# Altium schematic sheet CW308T-FE310-G002.SchDoc: FE310-G002 MCU and SPI
size Letter; SheetNumber: 1; SheetTotal: 2; SheetApproved: Yes
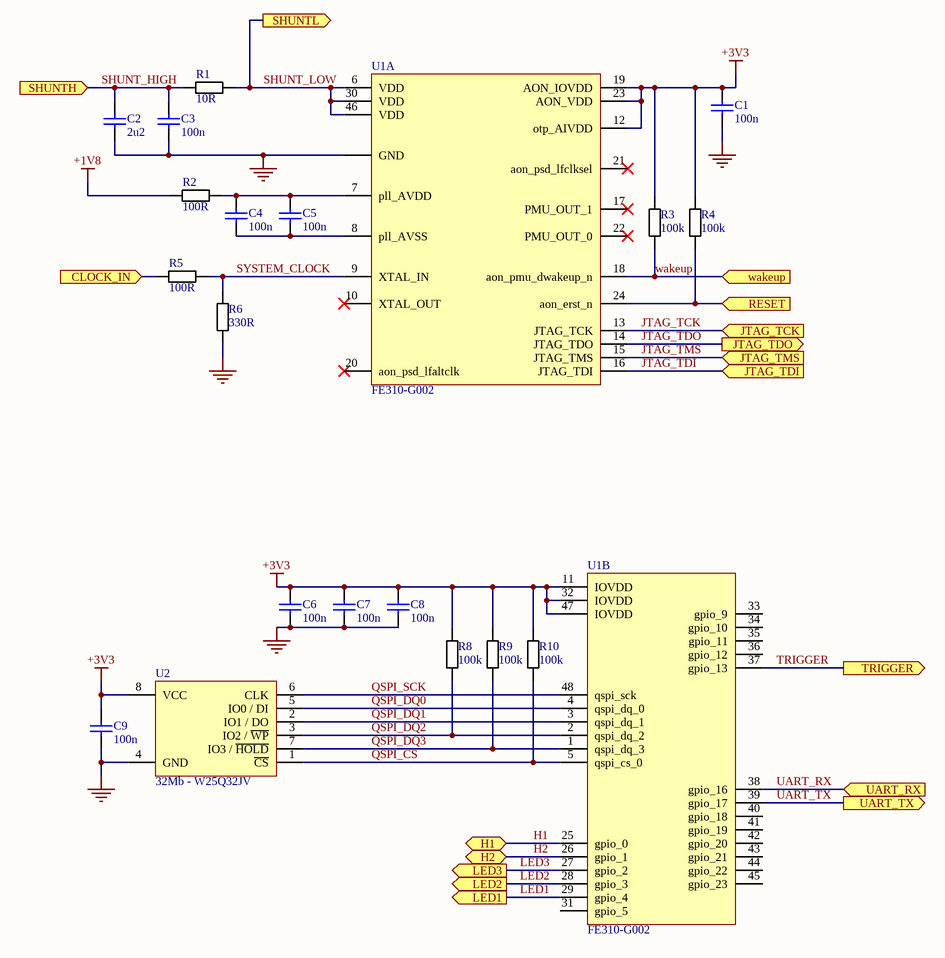
[diagram p0: CW308T-FE310-G002.SchDoc]

## Parts
C1  100n  [CAPC0603_M]
C2  2u2  [CAPC0603_M]
C3  100n  [CAPC0603_M]
C4  100n  [CAPC0603_M]
C5  100n  [CAPC0603_M]
C6  100n  [CAPC0603_M]
C7  100n  [CAPC0603_M]
C8  100n  [CAPC0603_M]
C9  100n  [CAPC0603_M]
R1  10R  [RESC1608X55N]
R2  100R  [RESC1608X55N]
R3  100k  [RESC1608X55N]
R4  100k  [RESC1608X55N]
R5  100R  [RESC1608X55N]
R6  330R  [RESC1608X55N]
R8  100k  [RESC1608X55N]
R9  100k  [RESC1608X55N]
R10  100k  [RESC1608X55N]
U1  FE310-G002  [QFN40P600X600X95_HS-49N]  (parts A,B of 2)
U2  32Mb - W25Q32JV  [SOIC127P790X216-8N]

## Ports
CLOCK_IN (in), H1 (bidir), H2 (bidir), JTAG_TCK (in), JTAG_TDI (in), JTAG_TDO (out), JTAG_TMS (in), LED1 (out), LED2 (out), LED3 (out), RESET (in), SHUNTH (in), SHUNTL (out), TRIGGER (out), UART_RX (in), UART_TX (out), wakeup (in)

## Nets
+1V8: R2.1
+3V3: C1.1 C6.1 C7.1 C8.1 C9.1 R3.1 R4.1 R8.1 R9.1 R10.1 U1.11(IOVDD) U1.12(otp_AIVDD) U1.19(AON_IOVDD) U1.23(AON_VDD) U1.32(IOVDD) U1.47(IOVDD) U2.8(VCC)
GND: C1.2 C2.2 C3.2 C6.2 C7.2 C8.2 C9.2 R6.2 U1.PAD(GND) U2.4(GND)
CLOCK_IN: R5.1 ; port CLOCK_IN
H1: U1.25(gpio_0) ; port H1
H2: U1.26(gpio_1) ; port H2
JTAG_TCK: U1.13(JTAG_TCK) ; port JTAG_TCK
JTAG_TDI: U1.16(JTAG_TDI) ; port JTAG_TDI
JTAG_TDO: U1.14(JTAG_TDO) ; port JTAG_TDO
JTAG_TMS: U1.15(JTAG_TMS) ; port JTAG_TMS
LED1: U1.29(gpio_4) ; port LED1
LED2: U1.28(gpio_3) ; port LED2
LED3: U1.27(gpio_2) ; port LED3
QSPI_CS: R10.2 U1.5(qspi_cs_0) U2.1(~{CS})
QSPI_DQ0: U1.4(qspi_dq_0) U2.5(IO0_/_DI)
QSPI_DQ1: U1.3(qspi_dq_1) U2.2(IO1_/_DO)
QSPI_DQ2: R8.2 U1.2(qspi_dq_2) U2.3(IO2_/_~{WP})
QSPI_DQ3: R9.2 U1.1(qspi_dq_3) U2.7(IO3_/_~{HOLD})
QSPI_SCK: U1.48(qspi_sck) U2.6(CLK)
RESET: R4.2 U1.24(aon_erst_n) ; port RESET
SHUNT_HIGH: C2.1 C3.1 R1.1 ; port SHUNTH
SHUNT_LOW: R1.2 U1.6(VDD) U1.30(VDD) U1.46(VDD) ; port SHUNTL
SYSTEM_CLOCK: R5.2 R6.1 U1.9(XTAL_IN)
TRIGGER: U1.37(gpio_13) ; port TRIGGER
UART_RX: U1.38(gpio_16) ; port UART_RX
UART_TX: U1.39(gpio_17) ; port UART_TX
wakeup: R3.2 U1.18(aon_pmu_dwakeup_n) ; port wakeup
NetC4_1: C4.1 C5.1 R2.2 U1.7(pll_AVDD)
NetC4_2: C4.2 C5.2 U1.8(pll_AVSS)

Not connected (* = marked no-connect by the designer): U1 10(XTAL_OUT)* 17(PMU_OUT_1)* 20(aon_psd_lfaltclk)* 21(aon_psd_lfclksel)* 22(PMU_OUT_0)* 31(gpio_5) 33(gpio_9) 34(gpio_10) 35(gpio_11) 36(gpio_12) 40(gpio_18) 41(gpio_19) 42(gpio_20) 43(gpio_21) 44(gpio_22) 45(gpio_23)

## Notes on the sheet
- Title:
- Date:
- Rev:
- Time:
- Project:
- Sheet
- of
- License:
- Copyright © NewAE Technology Inc.
- Approved:
- NewAE.com
- File:

## Library data of the parts
C1 C3-C9 = CCHIP-100n-0603: 100n, 0603; Manufacture 1: Kemet; Manufacture Part Number 1: C0603C104K5RACTU; Component Group: Capacitor; Case-EIA: 0603; Case-Metric: 1608; Rated Voltage: 50VDC; Part Number: CCHIP-100n-0603; Footprint: 0603; Pin Count: 2; Supplier 1: Digi-Key; Supplier Part Number 1: 399-5089-2-ND; Value: 100n; Mounting Technology: SMT; Component Kind: Standard; Component Type: Standard
C2 = CCHIP-2u2-0603: 2u2, 0603; Manufacture 1: Samsung; Manufacture Part Number 1: CL10B225KP8NNNC; Component Group: Capacitor; Case-EIA: 0603; Case-Metric: 1608; Rated Voltage: 10VDC; Part Number: CCHIP-2u2-0603; Footprint: 0603; Pin Count: 2; Supplier 1: Digi-Key; Supplier Part Number 1: 1276-1134-2-ND; Value: 2u2; Mounting Technology: SMT; Component Kind: Standard; Component Type: Standard
R1 = RCHIP-10R-0603: 10R res, 0603, 1%, 1/10W; Manufacture 1: Yageo; Manufacture Part Number 1: RC0603FR-0710RL; Component Group: Resistor; Case-EIA: 0603; Case-Metric: 1608; Rated Power: 0.1W; Rated Voltage: 75VDC; Part Number: RCHIP-10R-0603; Footprint: 0603; Pin Count: 2; Supplier 1: Digi-Key; Supplier Part Number 1: 311-10.0HRCT-ND; Value: 10R; Tolerance: 1%; Mounting Technology: SMT; Temperature Range: -55C to 155C; Component Kind: Standard; Component Type: Standard
R2 R5 = RCHIP-100R-0603: 100R res, 0603, 1%, 1/10W; Manufacture 1: Yageo; Manufacture Part Number 1: RC0603FR-07100RL; Component Group: Resistor; Case-EIA: 0603; Case-Metric: 1608; Rated Power: 0.1W; Rated Voltage: 75VDC; Part Number: RCHIP-100R-0603; Footprint: 0603; Pin Count: 2; Supplier 1: Digi-Key; Supplier Part Number 1: 311-100HRCT-ND; Value: 100R; Tolerance: 1%; Mounting Technology: SMT; Temperature Range: -55C to 155C; Component Kind: Standard; Component Type: Standard
R3 R4 R8-R10 = RCHIP-100K-0603: 100k res, 0603, 1%, 1/10W; Manufacture 1: Yageo; Manufacture Part Number 1: RC0603FR-07100KL; Component Group: Resistor; Case-EIA: 0603; Case-Metric: 1608; Rated Power: 0.1W; Rated Voltage: 75VDC; Part Number: RCHIP-100K-0603; Footprint: 0603; Pin Count: 2; Supplier 1: Digi-Key; Supplier Part Number 1: 311-100KHRCT-ND; Value: 100k; Tolerance: 1%; Mounting Technology: SMT; Temperature Range: -55C to 155C; Component Kind: Standard; Component Type: Standard
R6 = RCHIP-330R-0603: 330R res, 0603, 1%, 1/10W; Manufacture 1: Yageo; Manufacture Part Number 1: RC0603FR-07330RL; Component Group: Resistor; Case-EIA: 0603; Case-Metric: 1608; Rated Power: 0.1W; Rated Voltage: 75VDC; Part Number: RCHIP-330R-0603; Footprint: 0603; Pin Count: 2; Supplier 1: Digi-Key; Supplier Part Number 1: 311-330HRCT-ND; Value: 330R; Tolerance: 1%; Mounting Technology: SMT; Temperature Range: -55C to 155C; Component Kind: Standard; Component Type: Standard
U1 = FE310-G002: RISC-V FREEDOM SoC; Manufacture 1: SiFive; Component Group: Digital IC; PP Material Stack: 0; Part Number: FE310-G002; Footprint: QFN-48; Manufacture Part Number 1: FE310-G002; Pin Count: 48; Mounting Technology: SMT; Component Kind: Standard; Component Type: Standard; PP Rotation: 0
U2 = QSPI-FLASH-32M-32Mb: IC FLASH 32M SPI 133MHZ 8SOIC; Manufacture 1: Winbond Electronics; Manufacture Part Number 1: W25Q32JVSSIQ TR; Component Group: Digital IC; PP Material Stack: 0; Part Number: QSPI-FLASH-32M-32Mb; Footprint: 8SOIC; Pin Count: 8; Supplier 1: Digi-Key; Supplier Part Number 1: W25Q32JVSSIQCT-ND; Value: 32Mb; Mounting Technology: SMT; RoHS: Yes; Component Kind: Standard; Component Type: Standard; PP Rotation: 0